# EAGLE design tricorder-light-sensors-mk-2.1 (EAGLE 7.5.0)
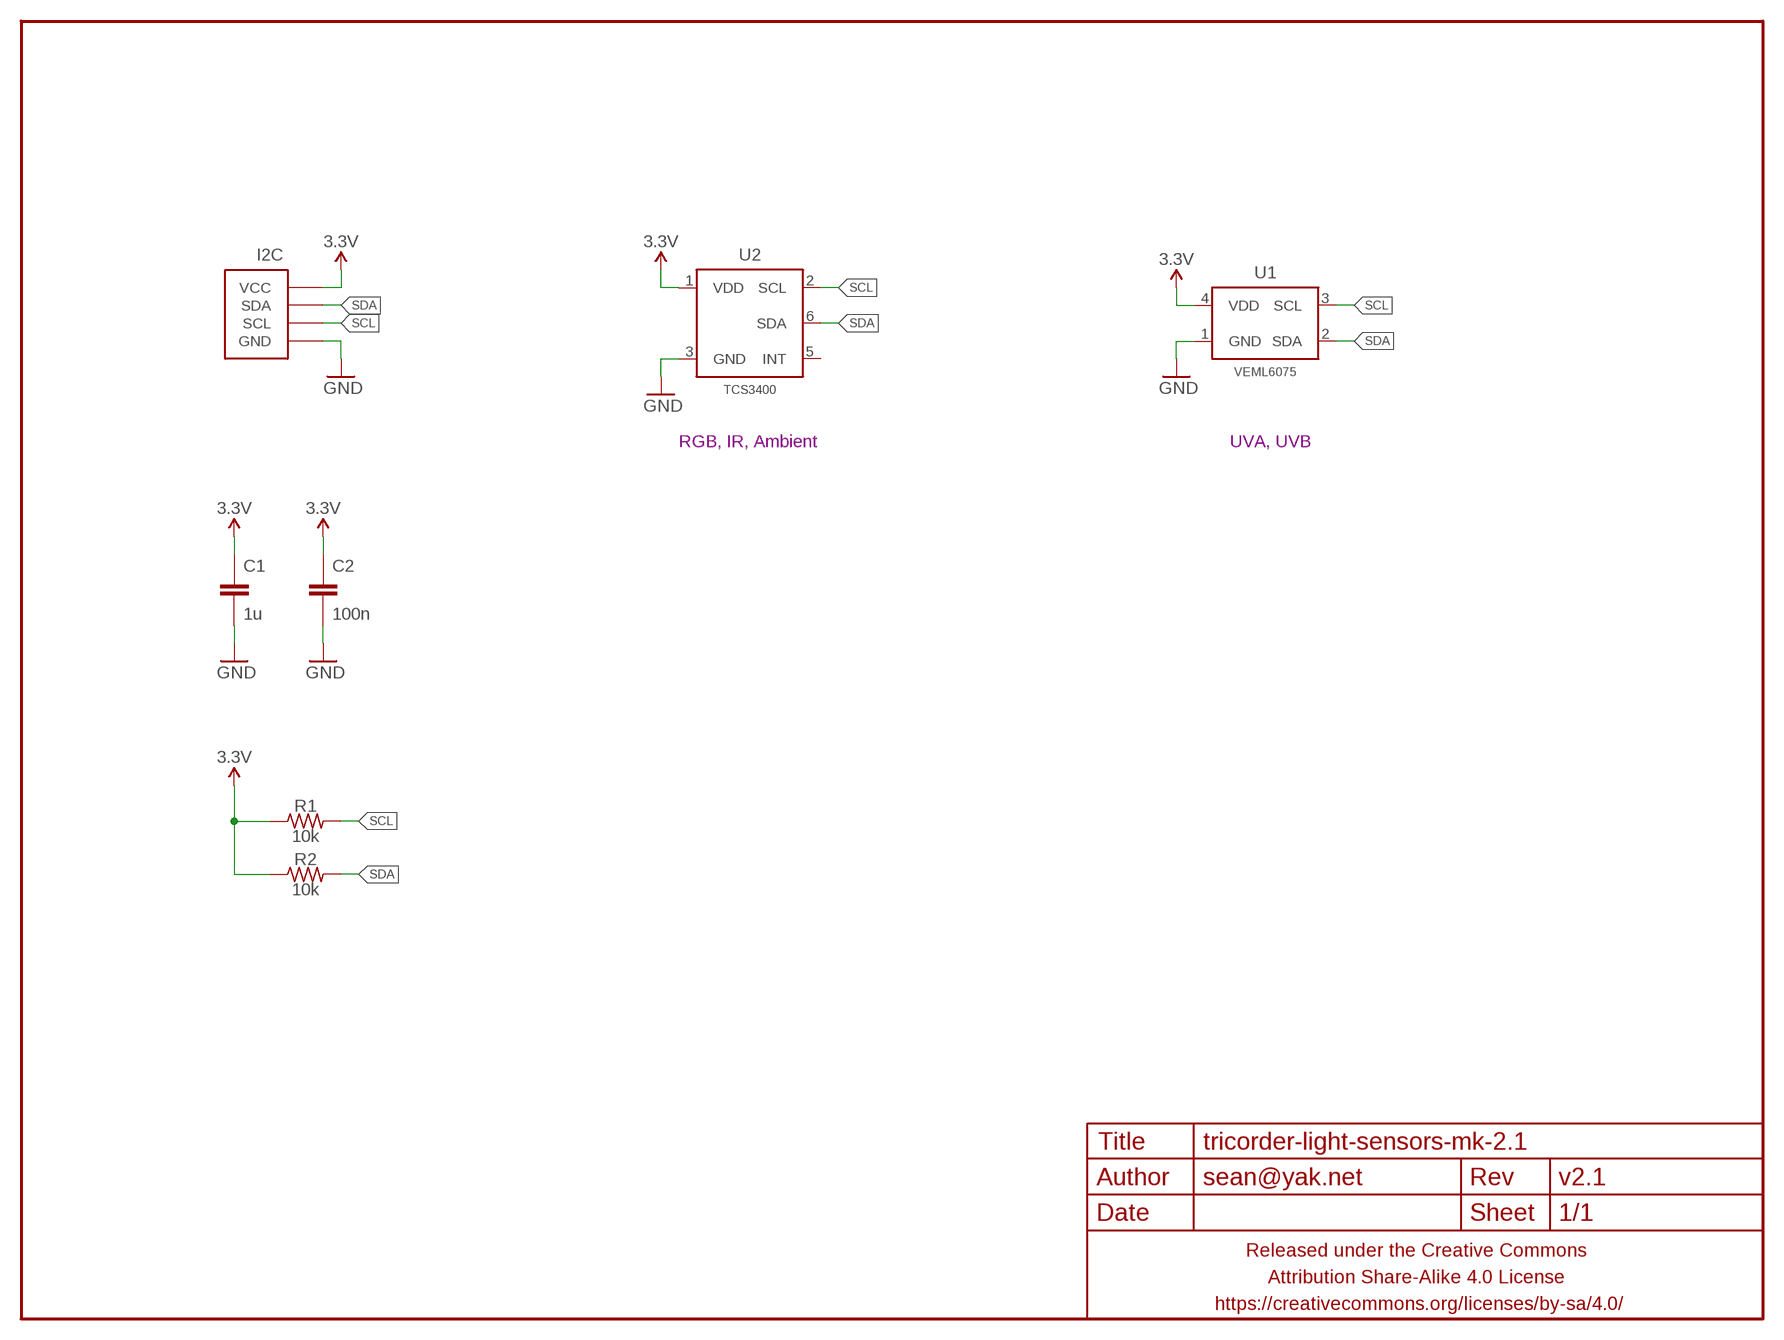
[diagram p0: schematic, sheet 1]

## Parts
C1  1u  CAPACITOR-CERAMICC0603  [C0603]
C2  100n  CAPACITOR-CERAMICC0603  [C0603]
FRAME1  FRAME-LETTERNO_PACKAGE  [DUMMY]
I2C  M04-I2CPTH-0.1IN-CENTERED  [1X04-PTH-VERT-I2C-CENTERED]
R1  10k  RESISTORR0603  [R0603]
R2  10k  RESISTORR0603  [R0603]
U1  VEML6075  [OPLGA4]
U2  TCS3400  TCS3400DFN6  [TCS3400_DFN6]

## Nets
3.3V: C1.1 C2.1 I2C.VCC R1.1 R2.1 U1.4(VDD) U2.1(VDD)
GND: C1.2 C2.2 I2C.GND U1.1(GND) U2.3(GND)
SCL: I2C.SCL R1.2 U1.3(SCL) U2.2(SCL)
SDA: I2C.SDA R2.2 U1.2(SDA) U2.6(SDA)
Unconnected: U2.5(INT)

## Notes on the sheet
- RGB, IR, Ambient | UVA, UVB

## Library data of the parts
C1 C2 = a_parts:CAPACITOR-CERAMIC: CAPACITOR, European symbol
FRAME1 = a_parts:FRAME-LETTER: Schematic Frame Standard 8.5x11 US Letter frame; DESIGNER: sean@yak.net; VERSION: v2.1
I2C = a_parts:M04-I2C
R1 R2 = a_parts:RESISTOR: RESISTOR, American symbol
U1 = a_parts:VEML6075
U2 = a_parts:TCS3400

## Board
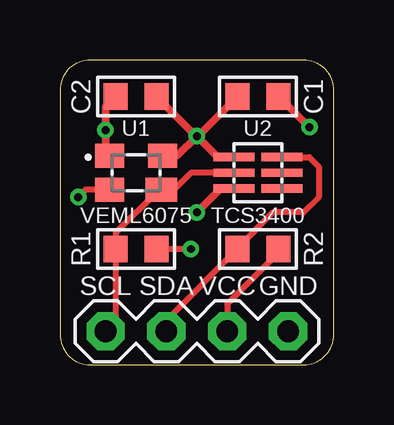
[diagram p1: board, top side]
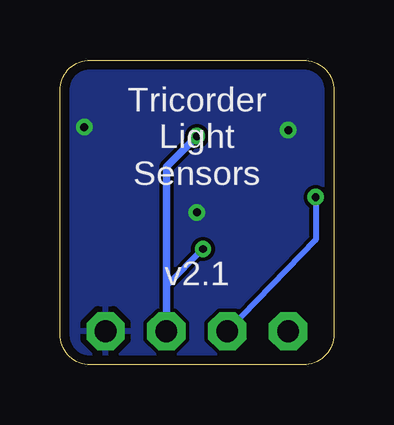
[diagram p2: board, bottom side, seen from below]

Size 11.43 x 12.7 mm. Coordinates in mm from the lower left corner, seen from the top.
Outline: 0,11.43 0,1.27 arc90 1.27,0 10.16,0 arc90 11.43,1.27 11.43,11.43 arc90 10.16,12.7 1.27,12.7 arc90 0,11.43
Copper layers (1*16): Top 0.0356mm / dielectric 1.5011mm / Bottom 0.0356mm
Design rules "LaenPCBOrder2": minimum track width 6mil, minimum drill 13mil, track to track 6mil, track to pad 6mil, pad to pad 6mil, via to via 6mil, smd to smd 6mil, copper to edge 15mil, drill to drill 6mil, minimum pad ring 7mil, minimum via ring 7mil, stop-mask expansion 3mil, vias tented up to drill 20mil, thermal gap 10mil

### Footprints (pad centres in the part's own frame; a part is rotated, then mirrored left to right if it is on the bottom)
C0603 = smd 1 x 1.1: 1 -0.85,0; 2 0.85,0
1X04-PTH-VERT-I2C-CENTERED = drill 0.9 pad 1.6 octagon: GND -3.81,0; SCL 3.81,0; SDA 1.27,0; VCC -1.27,0
R0603 = smd 1 x 1.1: 1 -0.85,0; 2 0.85,0
OPLGA4 = smd 1.2 x 1: 1 -1.1,0.7; 2 -1.1,-0.7; 4 1.1,0.7 | smd 1.3 x 1: 3 1.05,-0.7
TCS3400_DFN6 = smd 1.7 x 0.35: 1 -1,0.65; 2 -1,0; 3 -1,-0.65; 4 1,-0.65; 5 1,0; 6 1,0.65

### Placement (x,y rotation side)
C1  8.26,11.18 0 top
C2  3.17,11.18 180 top
FRAME1  0,0 0 top
I2C  5.71,1.4 180 top
R1  3.17,4.83 180 top
R2  8.26,4.83 180 top
U1  3.17,8 0 top
U2  8.26,8 0 top

### Tracks (layer width: path | path; a pad name or v marks a point on that pad's centre or on a via)
3.3V  (via drill 0.33)
  Top 0.254: R2.1 9.11,4.66 6.99,2.54 I2C.VCC | R1.1 v5.46,4.83
  Top 0.305: U1.4 4.89,8.7 v5.71,9.53 | U2.1 6.59,8.65 v5.71,9.53 | C2.1 5.68,9.53 v5.71,9.53 | C1.1 5.75,9.53 v5.71,9.53
  Bottom 0.254: v5.46,4.83 6.99,3.3 6.99,3.05
  Bottom 0.305: I2C.VCC 6.99,3.05 6.99,8.26 v5.71,9.53
GND  (via drill 0.33)
  Top 0.305: U2.3 6.72,7.35 v5.71,6.35 | C1.2 9.14,11.18 v10.41,9.91 | C2.2 1.91,10.76 v1.91,9.78 1.91,8.87 U1.1
  pour Bottom: 0,11.43 0,1.27 arc90 1.27,0 10.16,0 arc90 11.43,1.27 11.43,11.43 arc90 10.16,12.7 1.27,12.7 arc90
SCL
  Top 0.254: U2.2 5.46,8 4.76,7.3 U1.3 4.13,7.3 2.33,5.5 R1.2 2.33,1.82 I2C.SCL
SDA  (via drill 0.33)
  Top 0.254: I2C.SDA 4.45,1.87 R2.2 7.41,4.87 8.89,6.35 10.16,6.35 10.79,6.99 10.79,8.26 10.4,8.65 U2.6 | U1.2 1.08,7.3 v0.76,6.99
  Bottom 0.254: v0.76,6.99 0.76,5.21 I2C.SDA

### Text on the board
bPlace: Tricorder / Light / Sensors